# Altium schematic sheet MOUTING.SchDoc
size 420 x 297 mm; SheetNumber: 25; SheetTotal: 29
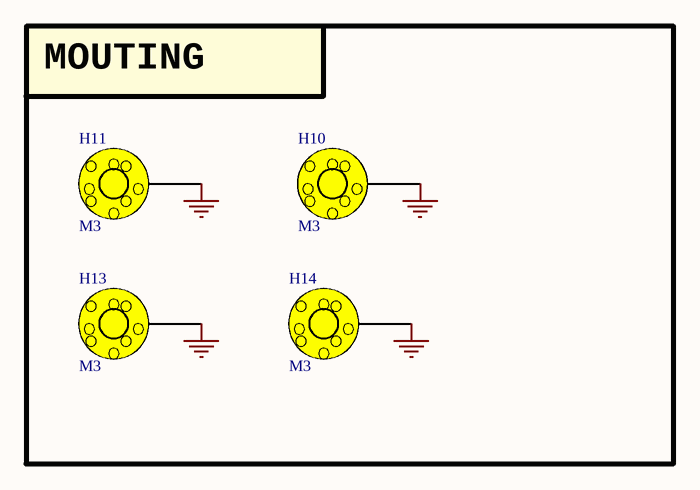
[diagram p0: MOUTING.SchDoc]

## Parts
H10  M3  [HEX-M3_NoVia]
H11  M3  [HEX-M3_NoVia]
H13  M3  [HEX-M3_NoVia]
H14  M3  [HEX-M3_NoVia]

## Blocks framed on the sheet
MOUTING: H10 H11 H13 H14

## Nets
GND: H10.1 H11.1 H13.1 H14.1

## Notes on the sheet
- Project:
- Sub-system:
- Design by:
- Sheet title:
- Sheet
- of
- Checked by:
- Approved by:
- Revision:
- Document No:
- Size:
- Date:
- A3

## Library data of the parts
H10 H11 H13 H14 = HEX-M3